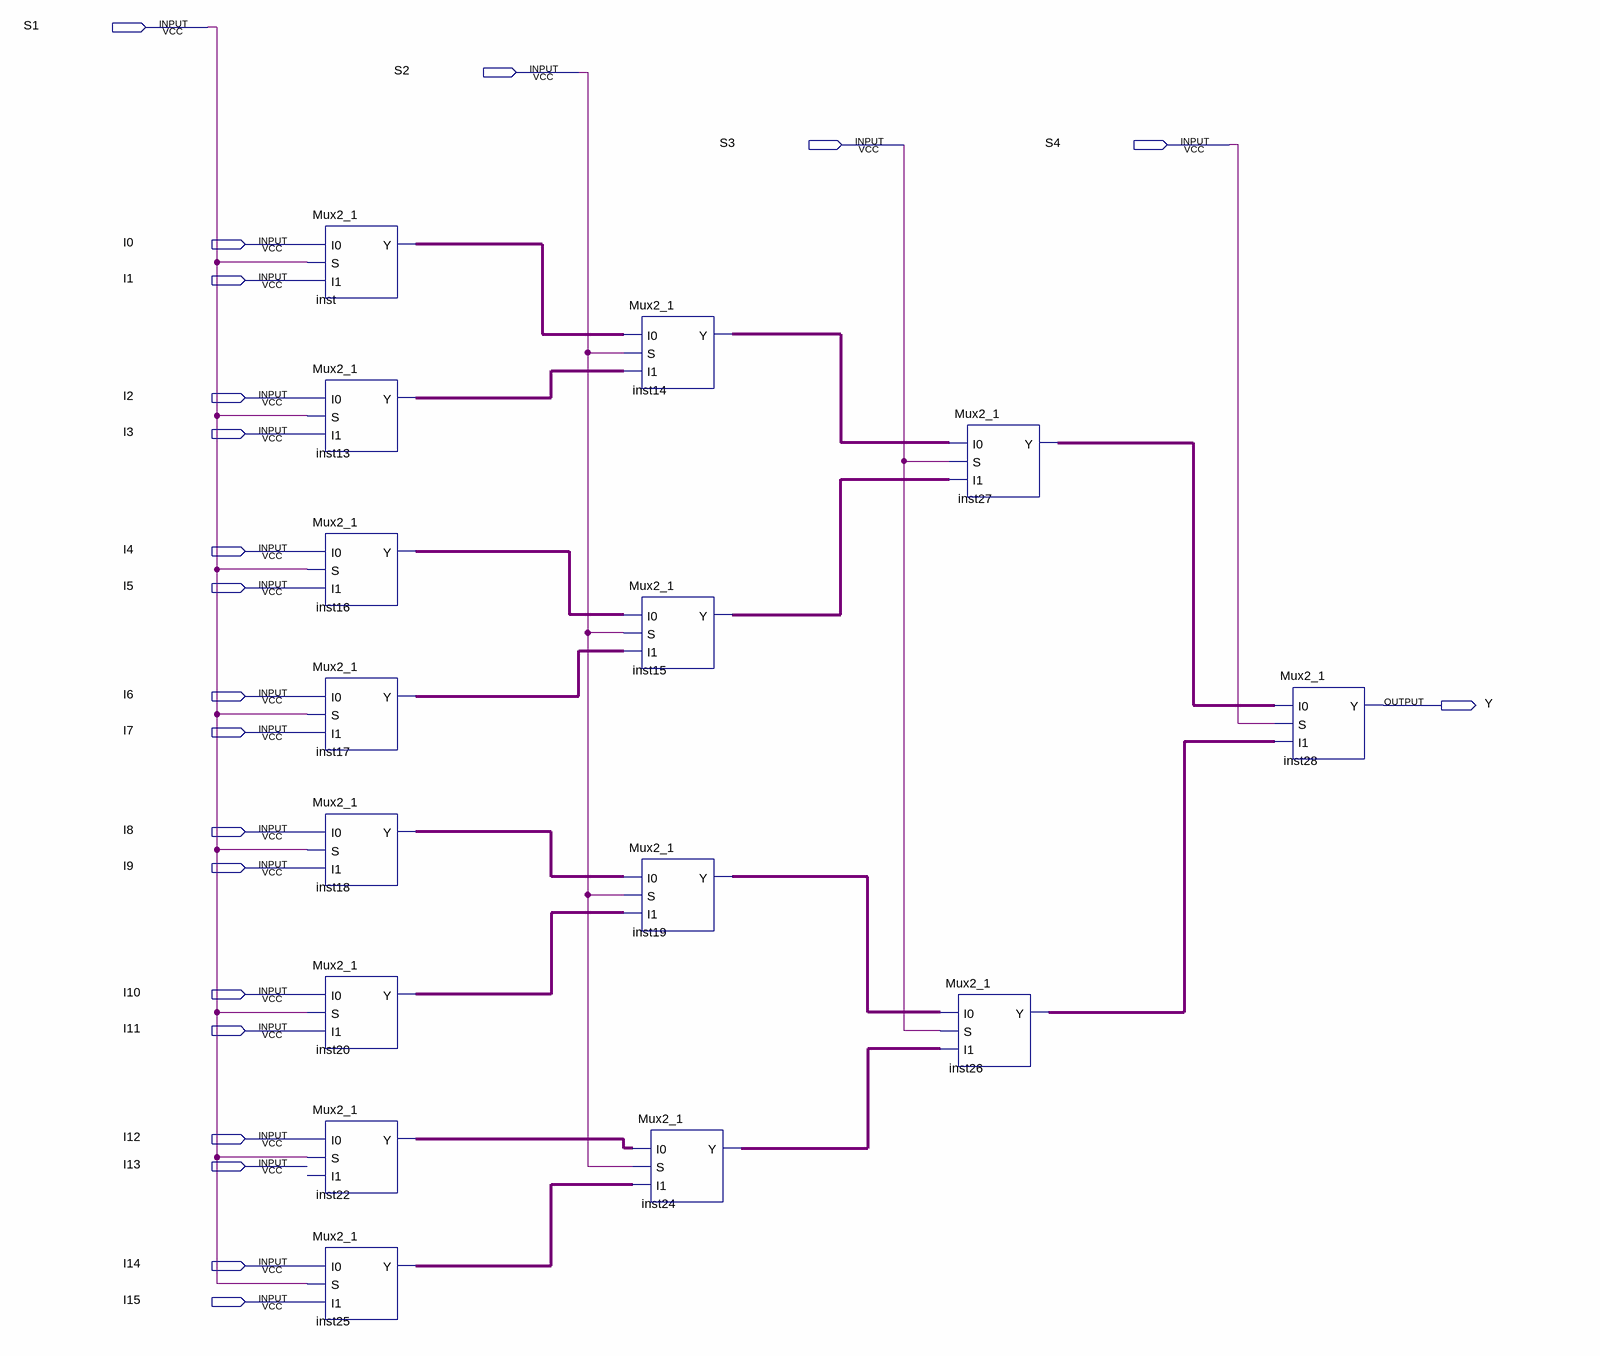
[diagram p0: schematic sheet]
// Quartus schematic Mux16_1.bdf as structural Verilog: 15 symbols, 21 pins
module Mux16_1 (
  input  S1,
  input  S2,
  input  S3,
  input  S4,
  input  I0,
  input  I1,
  input  I2,
  input  I3,
  input  I4,
  input  I5,
  input  I6,
  input  I7,
  input  I8,
  input  I9,
  input  I10,
  input  I11,
  input  I12,
  input  I13,
  input  I14,
  input  I15,
  output Y
);

  wire inst13_y, inst14_y, inst15_y, inst16_y, inst17_y, inst18_y, inst19_y, inst20_y, inst22_y, inst24_y,
       inst25_y, inst26_y, inst27_y, inst_y;

  Mux2_1 inst (.I0(I0), .S(S1), .I1(I1), .Y(inst_y));
  Mux2_1 inst13 (.I0(I2), .S(S1), .I1(I3), .Y(inst13_y));
  Mux2_1 inst16 (.I0(I4), .S(S1), .I1(I5), .Y(inst16_y));
  Mux2_1 inst17 (.I0(I6), .S(S1), .I1(I7), .Y(inst17_y));
  Mux2_1 inst18 (.I0(I8), .S(S1), .I1(I9), .Y(inst18_y));
  Mux2_1 inst20 (.I0(I10), .S(S1), .I1(I11), .Y(inst20_y));
  Mux2_1 inst22 (.I0(I12), .S(S1), .Y(inst22_y));  // open: I1
  Mux2_1 inst25 (.I0(I14), .S(S1), .I1(I15), .Y(inst25_y));
  Mux2_1 inst14 (.I0(inst_y), .S(S2), .I1(inst13_y), .Y(inst14_y));
  Mux2_1 inst15 (.I0(inst16_y), .S(S2), .I1(inst17_y), .Y(inst15_y));
  Mux2_1 inst19 (.I0(inst18_y), .S(S2), .I1(inst20_y), .Y(inst19_y));
  Mux2_1 inst24 (.I0(inst22_y), .S(S2), .I1(inst25_y), .Y(inst24_y));
  Mux2_1 inst27 (.I0(inst14_y), .S(S3), .I1(inst15_y), .Y(inst27_y));
  Mux2_1 inst26 (.I0(inst19_y), .S(S3), .I1(inst24_y), .Y(inst26_y));
  Mux2_1 inst28 (.I0(inst27_y), .S(S4), .I1(inst26_y), .Y(Y));
endmodule
